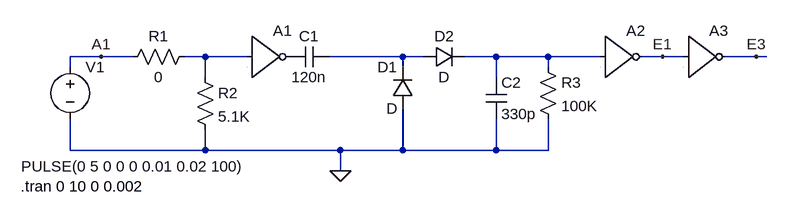
[diagram p0: schematic converter.asc]
converter.asc, the LTspice schematic file:
Version 4
SHEET 1 992 680
WIRE -48 112 -96 112
WIRE 0 112 -48 112
WIRE 112 112 80 112
WIRE 176 112 112 112
WIRE 416 112 304 112
WIRE 448 112 416 112
WIRE 560 112 512 112
WIRE 640 112 560 112
WIRE 720 112 640 112
WIRE 816 112 784 112
WIRE 848 112 816 112
WIRE 960 112 912 112
WIRE 976 112 960 112
WIRE -96 128 -96 112
WIRE 416 128 416 112
WIRE 640 128 640 112
WIRE 112 144 112 112
WIRE 560 144 560 112
WIRE -96 256 -96 208
WIRE 112 256 112 224
WIRE 112 256 -96 256
WIRE 320 256 112 256
WIRE 416 256 416 192
WIRE 416 256 320 256
WIRE 560 256 560 208
WIRE 560 256 416 256
WIRE 640 256 640 208
WIRE 640 256 560 256
WIRE 320 288 320 256
FLAG 320 288 0
FLAG 960 112 E3
FLAG 816 112 E1
FLAG -48 112 A1
SYMBOL res 96 96 R90
WINDOW 0 0 56 VBottom 2
WINDOW 3 32 56 VTop 2
SYMATTR InstName R1
SYMATTR Value 0
SYMBOL res 96 128 R0
SYMATTR InstName R2
SYMATTR Value 5.1K
SYMBOL cap 304 96 R90
WINDOW 0 0 32 VBottom 2
WINDOW 3 32 32 VTop 2
SYMATTR InstName C1
SYMATTR Value 120n
SYMBOL cap 544 144 R0
SYMATTR InstName C2
SYMATTR Value 330p
SYMBOL diode 432 192 R180
WINDOW 0 24 64 Left 2
WINDOW 3 24 0 Left 2
SYMATTR InstName D1
SYMBOL diode 448 128 R270
WINDOW 0 32 32 VTop 2
WINDOW 3 0 32 VBottom 2
SYMATTR InstName D2
SYMBOL res 624 112 R0
SYMATTR InstName R3
SYMATTR Value 100K
SYMBOL Digital\\inv 176 48 R0
SYMATTR InstName A1
SYMBOL voltage -96 112 R0
WINDOW 3 -75 169 Left 2
WINDOW 123 0 0 Left 2
WINDOW 39 0 0 Left 2
SYMATTR InstName V1
SYMATTR Value PULSE(0 5 0 0 0 0.01 0.02 100)
SYMBOL Digital\\inv 720 48 R0
SYMATTR InstName A2
SYMBOL Digital\\inv 848 48 R0
SYMATTR InstName A3
TEXT -172 312 Left 2 !.tran 0 10 0 0.002

The netlist it stands for:
* converter.asc
R1 N001 A1 0
R2 N001 0 5.1K
C1 N002 P001 120n
C2 N003 0 330p
D1 0 N002 D
D2 N002 N003 D
R3 N003 0 100K
A1 N001 0 0 0 0 P001 0 0 BUF
V1 A1 0 PULSE(0 5 0 0 0 0.01 0.02 100)
A2 N003 0 0 0 0 E1 0 0 BUF
A3 E1 0 0 0 0 E3 0 0 BUF
.model D D
.lib standard.dio
.tran 0 10 0 0.002
.backanno
.end